# Altium schematic sheet 2019_dev_driver.SchDoc: RemoteControl
size C; CompanyName: BUPT; DrawnBy: BUPT_ZeroVoid; Engineer: BUPT_ZeroVoid; Organization: BUPT_Robot; Revision: A; SheetNumber: 1; SheetTotal: 1; Version: 1.0; LibVersion: 3.0
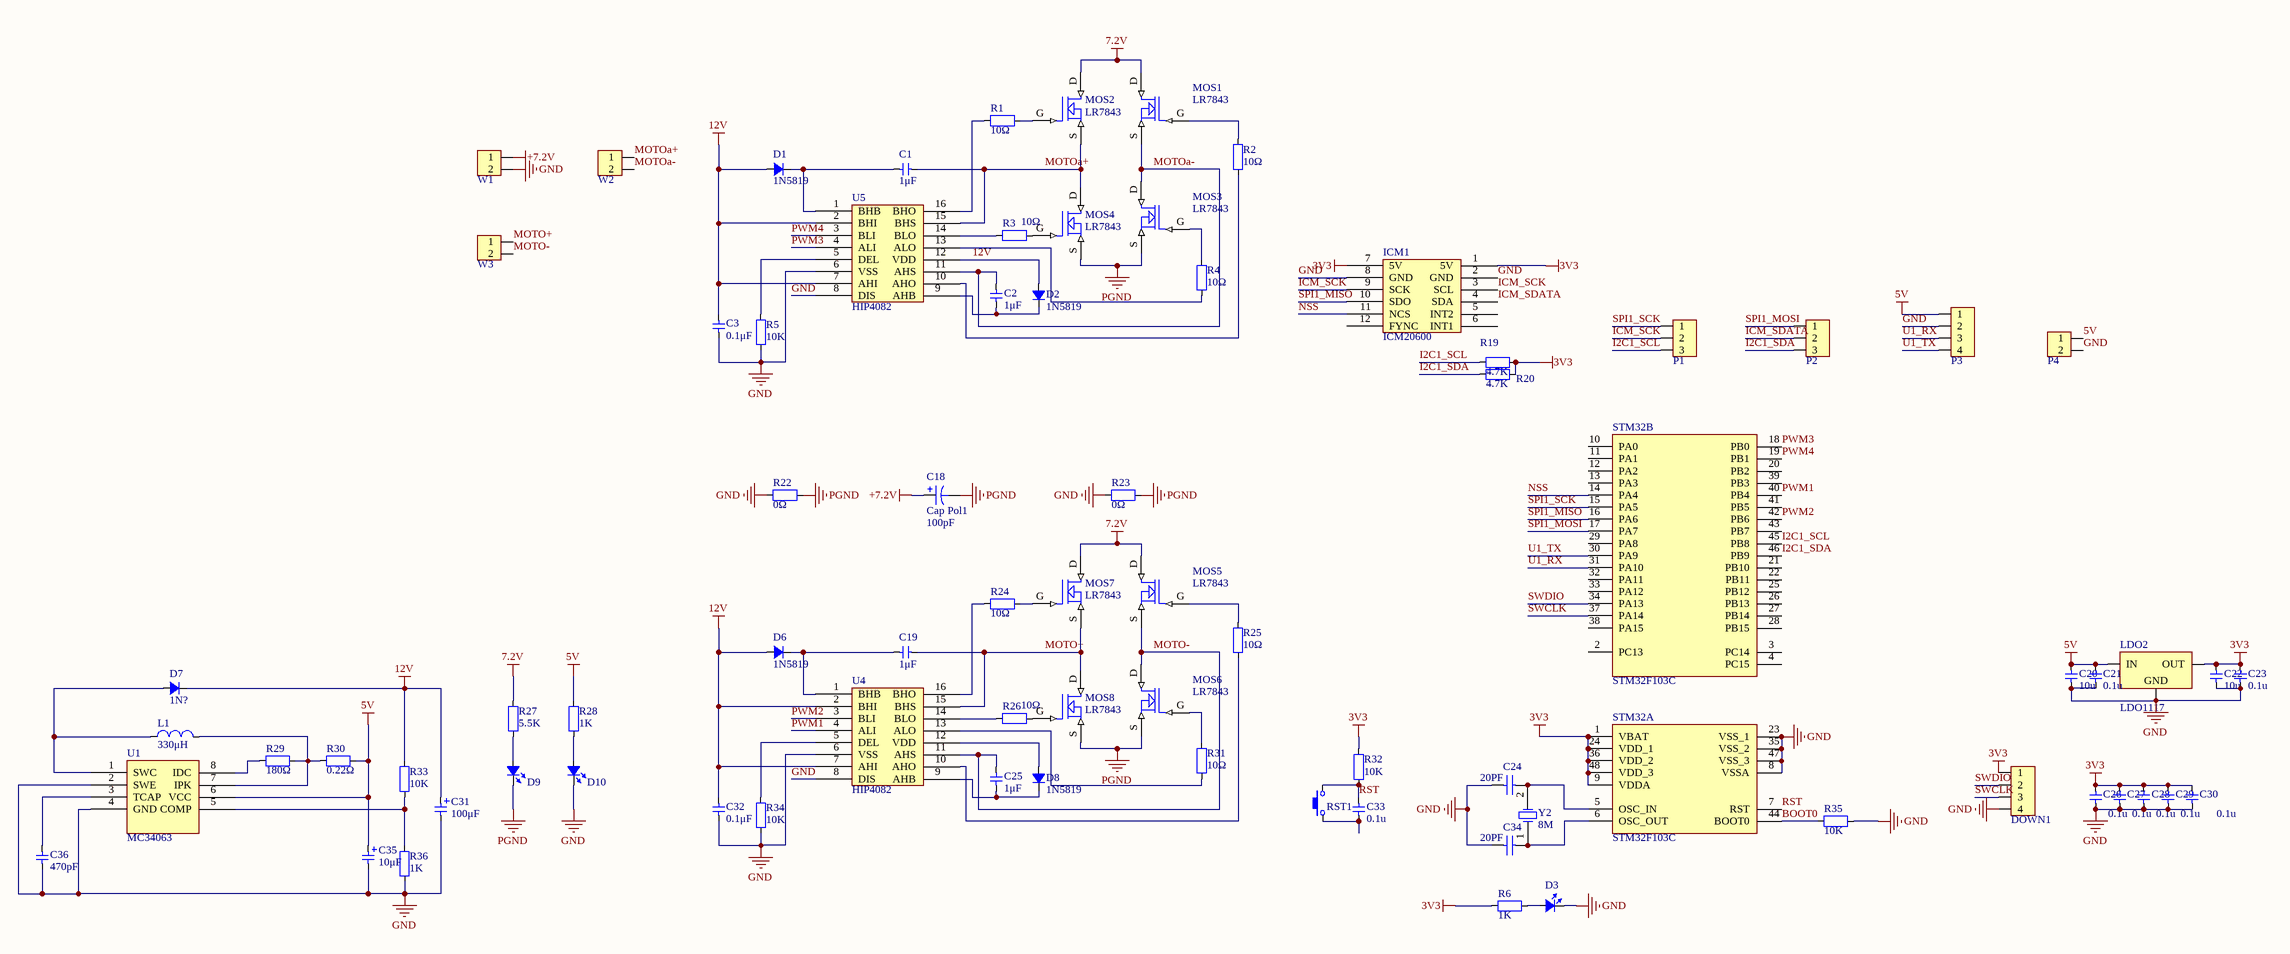
[diagram p0: 2019_dev_driver.SchDoc]

## Parts
C1  value 1μF  [CAP_0603]  (hidden comment: Cap_0603)
C2  value 1μF  [CAP_0603]  (hidden comment: Cap_0603)
C3  value 0.1μF  [CAP_0603]  (hidden comment: Cap_0603)
C18  Cap Pol1  value 100pF  [RB7.6-15]
C19  value 1μF  [CAP_0603]  (hidden comment: Cap_0603)
C20  value 10u  [CAP_0805]  (hidden comment: CAP_0805)
C21  value 0.1u  [CAP_0805]  (hidden comment: CAP_0805)
C22  value 10u  [CAP_0805]  (hidden comment: CAP_0805)
C23  value 0.1u  [CAP_0805]  (hidden comment: CAP_0805)
C24  value 20PF  [CAP_0805]  (hidden comment: Cap)
C25  value 1μF  [CAP_0603]  (hidden comment: Cap_0603)
C26  value 0.1u  [CAP_0805]  (hidden comment: CAP_0805)
C27  value 0.1u  [CAP_0805]  (hidden comment: CAP_0805)
C28  value 0.1u  [CAP_0805]  (hidden comment: CAP_0805)
C29  value 0.1u  [CAP_0805]  (hidden comment: CAP_0805)
C30  value 0.1u  [CAP_0805]  (hidden comment: CAP_0805)
C31  value 100μF  [CAP_TAN_D2917]  (hidden comment: Cap_Tan_2917)
C32  value 0.1μF  [CAP_0603]  (hidden comment: Cap_0603)
C33  value 0.1u  [CAP_0805]  (hidden comment: CAP_0805)
C34  value 20PF  [CAP_0805]  (hidden comment: Cap)
C35  value 10μF  [CAP_TAN_D2917]  (hidden comment: Cap_Tan_2917)
C36  value 470pF  [CAP_0603]  (hidden comment: Cap_0603)
D1  value 1N5819  [SOD-123]  (hidden comment: Diode_SOD123)
D2  value 1N5819  [SOD-123]  (hidden comment: Diode_SOD123)
D3  LED_0805  [LED_0805_RED]  (value not drawn)
D6  value 1N5819  [SOD-123]  (hidden comment: Diode_SOD123)
D7  value 1N?  [SOD-123]  (hidden comment: Diode_SOD123)
D8  value 1N5819  [SOD-123]  (hidden comment: Diode_SOD123)
D9  LED_5730  [LED_5730_WHITE]  (value not drawn)
D10  LED_5730  [LED_5730_WHITE]  (value not drawn)
DOWN1  HDR1x4_2.54  [HDR1x4_2.54_180]  (value not drawn)
ICM1  ICM20600  [ICM20600_mod]
L1  value 330μH  [IND_CD32]  (hidden comment: Ind_CD32)
LDO2  LDO1117  [SOT223-3]
MOS1  LR7843  [LR7843]
MOS2  LR7843  [LR7843]
MOS3  LR7843  [LR7843]
MOS4  LR7843  [LR7843]
MOS5  LR7843  [LR7843]
MOS6  LR7843  [LR7843]
MOS7  LR7843  [LR7843]
MOS8  LR7843  [LR7843]
P1  HDR1x3_2.54  [HDR1X3_2.54_180]  (value not drawn)
P2  HDR1x3_2.54  [HDR1X3_2.54_180]  (value not drawn)
P3  HDR1x4_2.54  [HDR1x4_2.54_180]  (value not drawn)
P4  HDR1x2_2.54  [HDR1X2_2.54_180]  (value not drawn)
R1  value 10Ω  [RES_0603]  (hidden comment: Res_0603)
R2  value 10Ω  [RES_0603]  (hidden comment: Res_0603)
R3  value 10Ω  [RES_0603]  (hidden comment: Res_0603)
R4  value 10Ω  [RES_0603]  (hidden comment: Res_0603)
R5  value 10K  [RES_0603]  (hidden comment: Res_0603)
R6  value 1K  [RES_0805]  (hidden comment: RES_0805)
R19  value 4.7K  [RES_0805]  (hidden comment: RES_0805)
R20  value 4.7K  [RES_0805]  (hidden comment: RES_0805)
R22  value 0Ω  [RES_0603]  (hidden comment: Res_0603)
R23  value 0Ω  [RES_0603]  (hidden comment: Res_0603)
R24  value 10Ω  [RES_0603]  (hidden comment: Res_0603)
R25  value 10Ω  [RES_0603]  (hidden comment: Res_0603)
R26  value 10Ω  [RES_0603]  (hidden comment: Res_0603)
R27  value 5.5K  [RES_0603]  (hidden comment: Res_0603)
R28  value 1K  [RES_0603]  (hidden comment: Res_0603)
R29  value 180Ω  [RES_0603]  (hidden comment: Res_0603)
R30  value 0.22Ω  [RES_0603]  (hidden comment: Res_0603)
R31  value 10Ω  [RES_0603]  (hidden comment: Res_0603)
R32  value 10K  [RES_0805]  (hidden comment: RES_0805)
R33  value 10K  [RES_0603]  (hidden comment: Res_0603)
R34  value 10K  [RES_0603]  (hidden comment: Res_0603)
R35  value 10K  [RES_0805]  (hidden comment: RES_0805)
R36  value 1K  [RES_0603]  (hidden comment: Res_0603)
RST1  ButtonTACT_3x6x2.5_180  [ButtonTACT_3x6x2.5_180]  (value not drawn)
STM32  STM32F103C  [LQFP_P0.5_48]  (parts A,B of 2)
U1  MC34063  [751-02_N]
U4  HIP4082  [SOP_E150_16]
U5  HIP4082  [SOP_E150_16]
W1  2Way_5  [2Way_5]  (value not drawn)
W2  2Way_5  [2Way_5]  (value not drawn)
W3  2Way_5  [2Way_5]  (value not drawn)
Y2  8M  [Osc-6032]

## Nets
3V3: C22.2 C23.2 C26.2 C27.2 C28.2 C29.2 C30.2 DOWN1.1 ICM1.1(5V) ICM1.7(5V) LDO2.2(OUT) R6.1 R19.1 R20.1 R32.2 STM32.1(VBAT) STM32.9(VDDA) STM32.24(VDD_1) STM32.36(VDD_2) STM32.48(VDD_3)
5V: C20.2 C21.2 C35.1 LDO2.3(IN) P3.1 P4.1 R28.2 R30.1 U1.6(VCC)
7.2V: MOS1.D MOS2.D MOS5.D MOS7.D R27.2
12V: C3.2 C31.1 C32.2 D1.1(A) D2.1(A) D6.1(A) D7.2(K) R33.2 U4.2(BHI) U4.7(AHI) U5.2(BHI) U5.7(AHI) U5.12(VDD)
+7.2V: C18.1 W1.1
GND: C3.1 C20.1 C21.1 C22.1 C23.1 C24.1 C26.1 C27.1 C28.1 C29.1 C30.1 C31.2 C32.1 C34.1 C35.2 C36.1 D3.2(K) D10.2(K) DOWN1.4 ICM1.2(GND) ICM1.8(GND) LDO2.1(GND) P3.2 P4.2 R5.1 R22.1 R23.1 R34.1 R35.2 R36.1 STM32.8(VSSA) STM32.23(VSS_1) STM32.35(VSS_2) STM32.47(VSS_3) U1.2(SWE) U1.4(GND) U4.6(VSS) U4.8(DIS) U5.6(VSS) U5.8(DIS) W1.2
PGND: C18.2 D9.2(K) MOS3.S MOS4.S MOS6.S MOS8.S R22.2 R23.2
BOOT0: R35.1 STM32.44(BOOT0)
I2C1_SCL: P1.3 R19.2 STM32.45(PB8)
I2C1_SDA: P2.3 R20.2 STM32.46(PB9)
ICM_SCK: ICM1.3(SCL) ICM1.9(SCK) P1.2
ICM_SDATA: ICM1.4(SDA) P2.2
MOTO+: C19.2 MOS7.S MOS8.D U4.15(BHS) W3.1
MOTO-: C25.2 MOS5.S MOS6.D U4.11(AHS) W3.2
MOTOa+: C1.2 MOS2.S MOS4.D U5.15(BHS) W2.1
MOTOa-: C2.2 MOS1.S MOS3.D U5.11(AHS) W2.2
NSS: ICM1.11(NCS) STM32.14(PA4)
PWM1: STM32.40(PB4) U4.4(ALI)
PWM2: STM32.42(PB6) U4.3(BLI)
PWM3: STM32.18(PB0) U5.4(ALI)
PWM4: STM32.19(PB1) U5.3(BLI)
RST: C33.2 R32.1 RST1.2 STM32.7(RST)
SPI1_MISO: ICM1.10(SDO) STM32.16(PA6)
SPI1_MOSI: P2.1 STM32.17(PA7)
SPI1_SCK: P1.1 STM32.15(PA5)
SWCLK: DOWN1.3 STM32.37(PA14)
SWDIO: DOWN1.2 STM32.34(PA13)
U1_RX: P3.3 STM32.31(PA10)
U1_TX: P3.4 STM32.30(PA9)
NetC1_1: C1.1 D1.2(K) U5.1(BHB)
NetC2_1: C2.1 D2.2(K) U5.9(AHB)
NetC19_1: C19.1 D6.2(K) U4.1(BHB)
NetC24_2: C24.2 STM32.5(OSC_IN) Y2.2(OSC2)
NetC25_1: C25.1 D8.2(K) U4.9(AHB)
NetC33_1: C33.1 RST1.1
NetC34_2: C34.2 STM32.6(OSC_OUT) Y2.1(OSC1)
NetC36_2: C36.2 U1.3(TCAP)
NetD3_1: D3.1(A) R6.2
NetD7_1: D7.1(A) L1.1 U1.1(SWC)
NetD8_1: D8.1(A) U4.12(VDD)
NetD9_1: D9.1(A) R27.1
NetD10_1: D10.1(A) R28.1
NetL1_2: L1.2 R29.1 R30.2 U1.7(IPK)
NetMOS1_G: MOS1.G R2.2
NetMOS2_G: MOS2.G R1.2
NetMOS3_G: MOS3.G R4.2
NetMOS4_G: MOS4.G R3.2
NetMOS5_G: MOS5.G R25.2
NetMOS6_G: MOS6.G R31.2
NetMOS7_G: MOS7.G R24.2
NetMOS8_G: MOS8.G R26.2
NetR1_1: R1.1 U5.16(BHO)
NetR2_1: R2.1 U5.10(AHO)
NetR3_1: R3.1 U5.14(BLO)
NetR4_1: R4.1 U5.13(ALO)
NetR5_2: R5.2 U5.5(DEL)
NetR24_1: R24.1 U4.16(BHO)
NetR25_1: R25.1 U4.10(AHO)
NetR26_1: R26.1 U4.14(BLO)
NetR29_2: R29.2 U1.8(IDC)
NetR31_1: R31.1 U4.13(ALO)
NetR33_1: R33.1 R36.2 U1.5(COMP)
NetR34_2: R34.2 U4.5(DEL)

Not connected (* = marked no-connect by the designer): ICM1 5(INT2) 6(INT1) 12(FYNC); STM32 2(PC13) 3(PC14) 4(PC15) 10(PA0) 11(PA1) 12(PA2) 13(PA3) 20(PB2) 21(PB10) 22(PB11) 25(PB12) 26(PB13) 27(PB14) 28(PB15) 29(PA8) 32(PA11) 33(PA12) 38(PA15) 39(PB3) 41(PB5) 43(PB7)

## Notes on the sheet
- Title
- Size:
- Date:
- File:
- C
- Number:
- Time:
- Revision:
- Sheet
- of

## Library data of the parts
C1-C3 C19-C23 C25-C30 C32 C33 C36 = Cap_0603: Capacitor
C18 = Cap Pol1: Polarized Capacitor (Radial); Published: 8-Jun-2000; LatestRevisionDate: 17-Jul-2002; LatestRevisionNote: Re-released for DXP Platform.; PackageReference: RB7.6-15; Publisher: Altium Limited; PackageDescription: Polarized Capacitor (Radial); 2 Leads
C24 C34 = Cap_1: Capacitor; Published: 8-Jun-2000; LatestRevisionDate: 17-Jul-2002; LatestRevisionNote: Re-released for DXP Platform.; PackageReference: RAD-0.3; Publisher: Altium Limited
C31 C35 = Cap_Tan_2917: Capacitor
D1 D2 D6-D8 = Diode_SOD123: Diode
D3 = LED_0805: LED
D9 D10 = LED_5730: LED
DOWN1 P3 = HDR1x4_2.54: Header
L1 = Ind_CD32: Inductor
LDO2 = LDO1117: Power
P1 P2 = HDR1x3_2.54: Header
P4 = HDR1x2_2.54T: Header
R1-R5 R22-R31 R33 R34 R36 = Res_0603: Resistor
R6 R19 R20 R32 R35 = RES_0805: Resistor
RST1 = ButtonTACT_3x6x2.5_180: Button
STM32 = STM32F103C: MCU
W1-W3 = 2Way_5: DB
Y2 = C-Osc: Crystal Oscillator; Published: 8-Jun-2000; LatestRevisionDate: 17-Jul-2002; LatestRevisionNote: Re-released for DXP Platform.; PackageReference: R38; Publisher: Altium Limited; PackageDescription: Crystal, Thru-Hole; 2 Leads; Body 3.1 x 8.2 mm (Dia.xH)